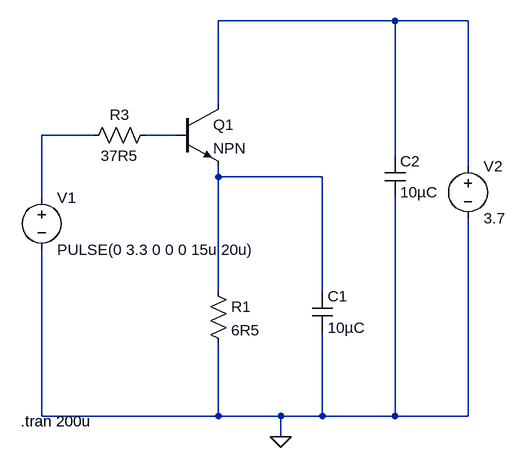
[diagram p0: schematic Drone-Motor-Simulation.asc]
Drone-Motor-Simulation.asc, the LTspice schematic file:
Version 4
SHEET 1 880 680
WIRE 464 -16 192 -16
WIRE 576 -16 464 -16
WIRE 192 112 192 -16
WIRE 0 160 -80 160
WIRE 128 160 80 160
WIRE 464 192 464 -16
WIRE 576 208 576 -16
WIRE 192 224 192 208
WIRE 352 224 192 224
WIRE -80 256 -80 160
WIRE 192 400 192 224
WIRE 352 400 352 224
WIRE -80 592 -80 336
WIRE 192 592 192 480
WIRE 192 592 -80 592
WIRE 288 592 192 592
WIRE 352 592 352 464
WIRE 352 592 288 592
WIRE 464 592 464 256
WIRE 464 592 352 592
WIRE 576 592 576 288
WIRE 576 592 464 592
WIRE 288 624 288 592
FLAG 288 624 0
SYMBOL npn 128 112 R0
SYMATTR InstName Q1
SYMBOL res 176 384 R0
SYMATTR InstName R1
SYMATTR Value 6R5
SYMBOL voltage -80 240 R0
WINDOW 123 0 0 Left 0
WINDOW 39 24 124 Left 2
SYMATTR InstName V1
SYMATTR Value PULSE(0 3.3 0 0 0 15u 20u)
SYMBOL voltage 576 192 R0
WINDOW 123 0 0 Left 0
WINDOW 39 24 124 Left 2
SYMATTR InstName V2
SYMATTR Value 3.7
SYMBOL res 96 144 R90
WINDOW 0 0 56 VBottom 2
WINDOW 3 32 56 VTop 2
SYMATTR InstName R3
SYMATTR Value 37R5
SYMBOL cap 336 400 R0
SYMATTR InstName C1
SYMATTR Value 10µC
SYMBOL cap 448 192 R0
SYMATTR InstName C2
SYMATTR Value 10µC
TEXT -112 600 Left 2 !.tran 200u

The netlist it stands for:
* Drone-Motor-Simulation.asc
Q1 N001 N003 N004 0 NPN
R1 N004 0 6R5
V1 N002 0 PULSE(0 3.3 0 0 0 15u 20u)
V2 N001 0 3.7
R3 N003 N002 37R5
C1 N004 0 10µC
C2 N001 0 10µC
.model NPN NPN
.model PNP PNP
.lib standard.bjt
.tran 200u
.backanno
.end